# EAGLE design selflace (EAGLE 9.4.0)
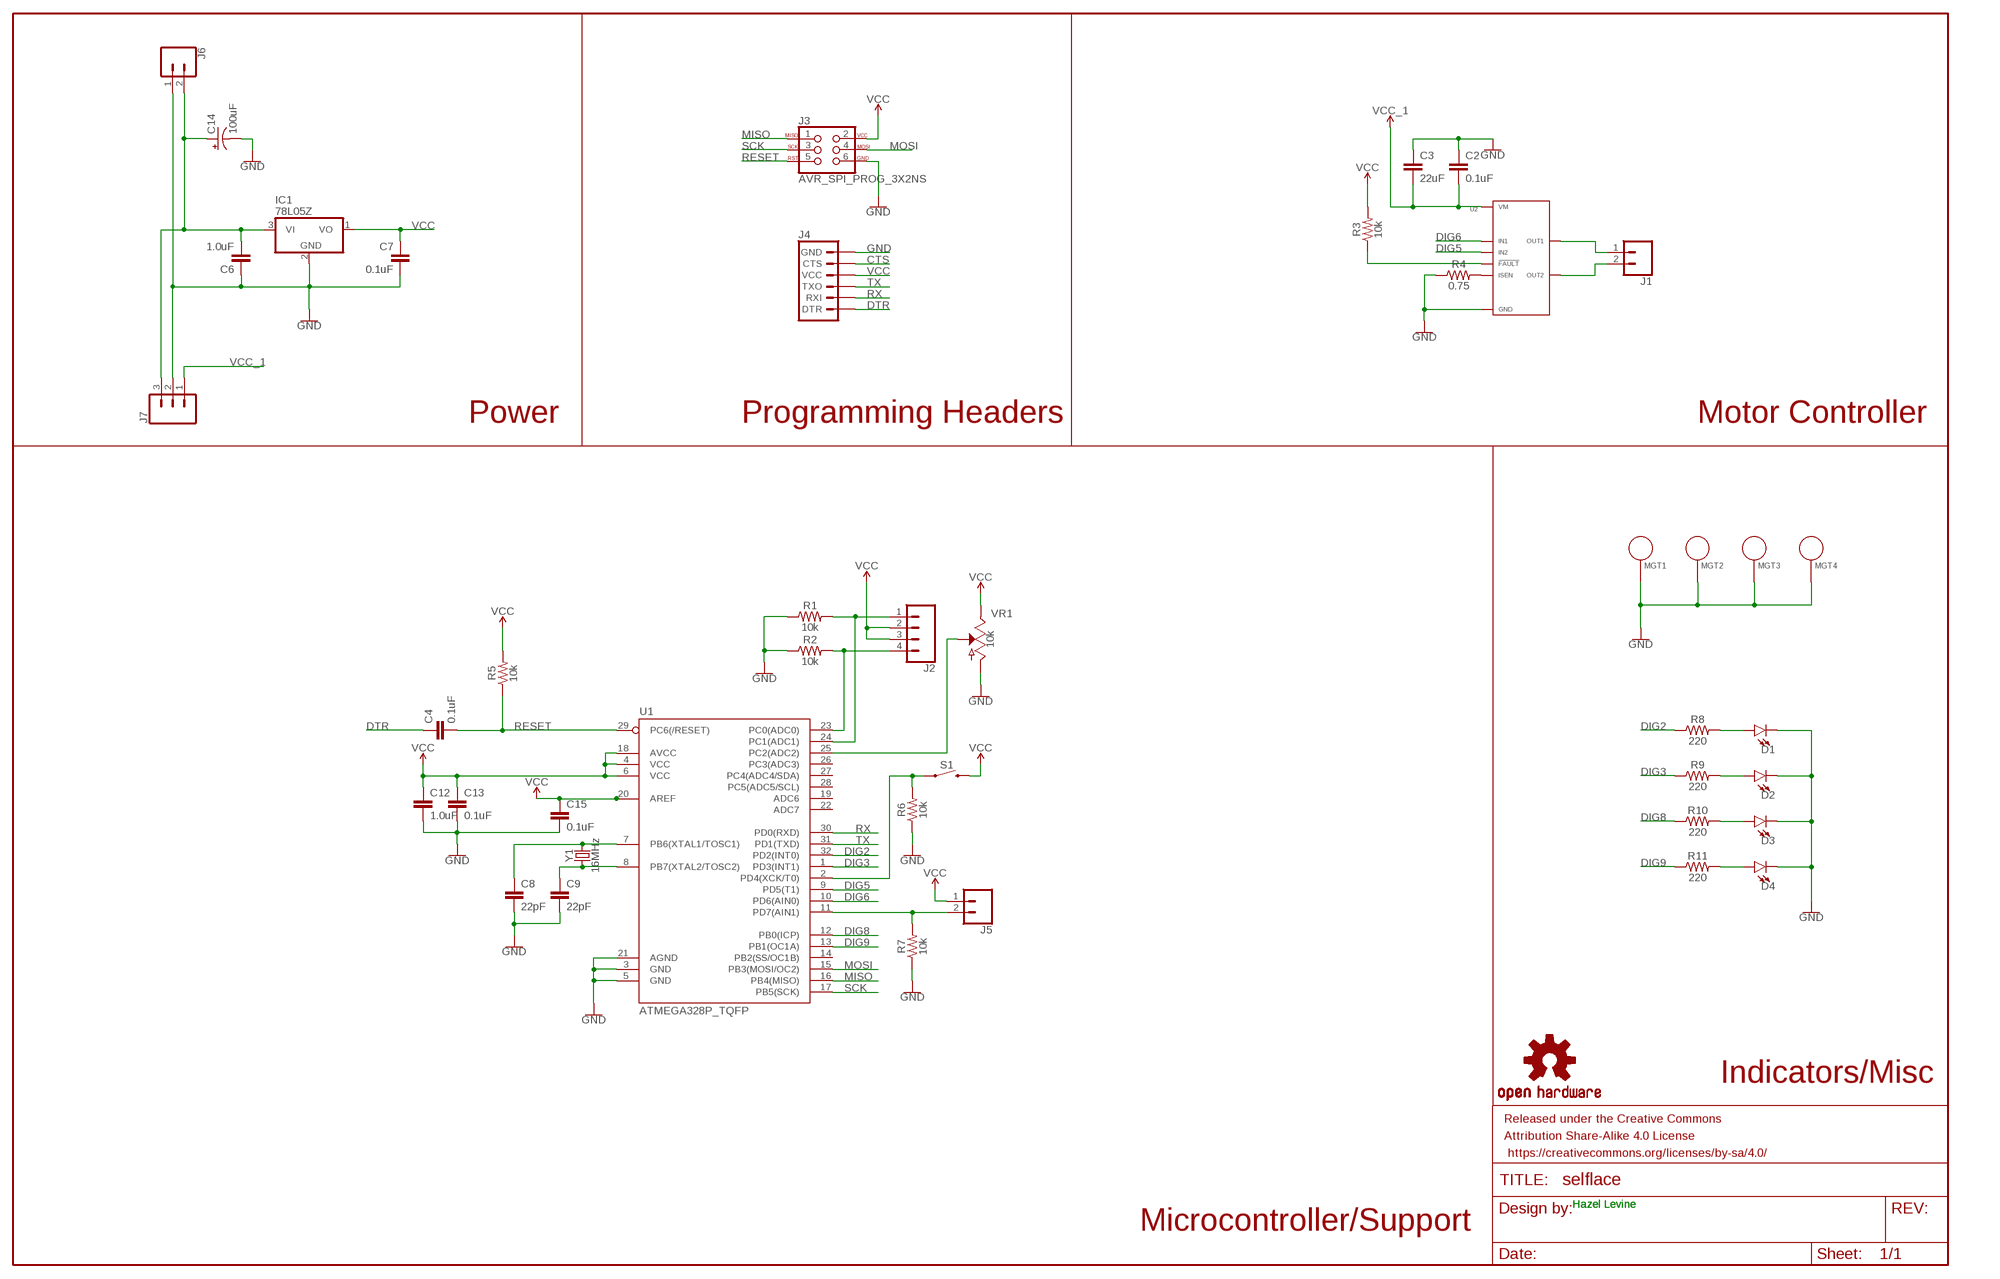
[diagram p0: schematic, sheet 1]

## Parts
C2  0.1uF  0.1UF-0603-25V-(+80/-20%)  [0603]
C3  22uF  22UF-0805-6.3V-20%  [0805]
C4  0.1uF  0.1UF-0603-25V-(+80/-20%)  [0603]
C6  1.0uF  1.0UF-0603-16V-10%  [0603]
C7  0.1uF  0.1UF-0603-25V-(+80/-20%)  [0603]
C8  22pF  22PF-0603-50V-5%  [0603]
C9  22pF  22PF-0603-50V-5%  [0603]
C12  1.0uF  1.0UF-0603-16V-10%  [0603]
C13  0.1uF  0.1UF-0603-25V-(+80/-20%)  [0603]
C14  100uF  100UF-POLAR-10X10.5-63V-20%  [NIC_10X10.5_CAP]
C15  0.1uF  0.1UF-0603-25V-(+80/-20%)  [0603]
D1  LED1206  [LED-1206]
D2  LED1206  [LED-1206]
D3  LED1206  [LED-1206]
D4  LED1206  [LED-1206]
FRAME1  FRAME-LEDGER  [CREATIVE_COMMONS]
IC1  78L05Z  [TO92]
J1  CONN_02  [1X02]
J2  CONN_04  [1X04]
J3  AVR_SPI_PROG_3X2NS  [2X3-NS]
J4  6_PIN_SERIAL_TARGETSILK  [6_PIN_SERIAL_TARGET_SIDE_W_SILK]
J5  CONN_02  [1X02]
J6  CONN_02JST-PTH-2  [JST-2-PTH]
J7  CONN_03  [1X03]
LOGO1  OSHW-LOGOM  [OSHW-LOGO-M]
MGT1  BEAGLEBONEBLACK_MOUNTING_HOLE  [BEAGLEBONEBLACK_MOUNTING_HOLE]
MGT2  BEAGLEBONEBLACK_MOUNTING_HOLE  [BEAGLEBONEBLACK_MOUNTING_HOLE]
MGT3  BEAGLEBONEBLACK_MOUNTING_HOLE  [BEAGLEBONEBLACK_MOUNTING_HOLE]
MGT4  BEAGLEBONEBLACK_MOUNTING_HOLE  [BEAGLEBONEBLACK_MOUNTING_HOLE]
R1  10k  10KOHM-0603-1/10W-1%  [0603]
R2  10k  10KOHM-0603-1/10W-1%  [0603]
R3  10k  10KOHM-0603-1/10W-1%  [0603]
R4  0.75  0.75OHM-0805-1/4W-1%  [0805]
R5  10k  10KOHM-0603-1/10W-1%  [0603]
R6  10k  10KOHM-0603-1/10W-1%  [0603]
R7  10k  10KOHM-0603-1/10W-1%  [0603]
R8  220  220OHM-0603-1/10W-1%  [0603]
R9  220  220OHM-0603-1/10W-1%  [0603]
R10  220  220OHM-0603-1/10W-1%  [0603]
R11  220  220OHM-0603-1/10W-1%  [0603]
S1  MOMENTARY-SWITCH-SPST-PTH-6.0MM  [TACTILE_SWITCH_PTH_6.0MM]
U1  ATMEGA328P_TQFP  [TQFP32-08]
U2  DRV8872DDARQ1  [DRV8872_HSOP-8]
VR1  10k  POTENTIOMETER-PTH-9MM-1/20W-20%  [POT-PTH-ALPS]
Y1  16MHz  CRYSTAL-16MHZSMD-5X3.2  [CRYSTAL-SMD-5X3.2-4PAD]

## Nets
CTS: J4.P$5(CTS)
DIG2: R8.1 U1.32(PD2(INT0))
DIG3: R9.1 U1.1(PD3(INT1))
DIG5: U1.9(PD5(T1)) U2.P$2(IN2)
DIG6: U1.10(PD6(AIN0)) U2.P$3(IN1)
DIG8: R10.1 U1.12(PB0(ICP))
DIG9: R11.1 U1.13(PB1(OC1A))
DTR: C4.1 J4.P$1(DTR)
GND: C2.1 C3.1 C6.1 C7.2 C8.2 C9.2 C12.2 C13.2 C14.- C15.2 D1.C D2.C D3.C D4.C IC1.2(GND) J3.6 J4.P$6(GND) J6.1 J7.2 MGT1.P$1 MGT2.P$1 MGT3.P$1 MGT4.P$1 R1.1 R2.1 R4.1 R6.1 R7.1 U1.3(GND) U1.5(GND) U1.21(AGND) U2.P$1(GND) U2.P$9(GND) U2.P$10(GND) U2.P$11(GND) U2.P$12(GND) U2.P$13(GND) U2.P$14(GND) U2.P$15(GND) VR1.P$3(A)
MISO: J3.1 U1.16(PB4(MISO))
MOSI: J3.4 U1.15(PB3(MOSI/OC2))
N$1: R6.2 S1.1 U1.2(PD4(XCK/T0))
N$2: J5.2 R7.2 U1.11(PD7(AIN1))
N$3: R3.1 U2.P$4(!FAULT)
N$4: J1.1 U2.P$6(OUT1)
N$5: J1.2 U2.P$8(OUT2)
N$6: U1.25(PC2(ADC2)) VR1.P$2(S)
N$7: C8.1 U1.7(PB6(XTAL1/TOSC1)) Y1.3
N$8: R4.2 U2.P$7(ISEN)
N$9: J2.4 R2.2 U1.23(PC0(ADC0))
N$10: J2.1 R1.2 U1.24(PC1(ADC1))
N$11: C9.1 U1.8(PB7(XTAL2/TOSC2)) Y1.1
N$12 [voltage]: C6.2 C14.+ IC1.3(VI) J6.2 J7.3
N$14: D1.A R8.2
N$15: D2.A R9.2
N$16: D3.A R10.2
N$17: D4.A R11.2
RESET: C4.2 J3.5 R5.1 U1.29(PC6(/RESET))
RX: J4.P$3(RXI) U1.30(PD0(RXD))
SCK: J3.3 U1.17(PB5(SCK))
TX: J4.P$2(TXO) U1.31(PD1(TXD))
VCC [voltage]: C7.1 C12.1 C13.1 C15.1 IC1.1(VO) J2.2 J2.3 J3.2 J4.P$4(VCC) J5.1 R3.2 R5.2 S1.3 U1.4(VCC) U1.6(VCC) U1.18(AVCC) U1.20(AREF) VR1.P$1(E)
VCC_1 [voltage]: C2.2 C3.2 J7.1 U2.P$5(VM)
Unconnected: U1.14(PB2(SS/OC1B)) U1.19(ADC6) U1.22(ADC7) U1.26(PC3(ADC3)) U1.27(PC4(ADC4/SDA)) U1.28(PC5(ADC5/SCL))

## Notes on the sheet
- Power | Programming Headers | Motor Controller
- Indicators/Misc
- Hazel Levine | Hazel Levine
- Microcontroller/Support

## Library data of the parts
C2 C4 C7 C13 C15 = SparkFun-Capacitors:0.1UF: 0.1µF ceramic capacitors A capacitor is a passive two-terminal electrical component used to store electrical energy temporarily in an electric field.; PROD_ID: CAP-00810
C3 = SparkFun-Capacitors:22UF: 22µF ceramic capacitors A capacitor is a passive two-terminal electrical component used to store electrical energy temporarily in an electric field.; PROD_ID: CAP-08402
C6 C12 = SparkFun-Capacitors:1.0UF: 1µF ceramic capacitors A capacitor is a passive two-terminal electrical component used to store electrical energy temporarily in an electric field.; PROD_ID: CAP-00868
C8 C9 = SparkFun-Capacitors:22PF: 22pF ceramic capacitors A capacitor is a passive two-terminal electrical component used to store electrical energy temporarily in an electric field.; PROD_ID: CAP-07876
C14 = SparkFun-Capacitors:100UF-POLAR: 100µF polarized capacitors A capacitor is a passive two-terminal electrical component used to store electrical energy temporarily in an electric field.; PROD_ID: CAP-08362
D1-D4 = SparkFun-LED:LED: LED (Generic) Standard schematic elements and footprints for 5mm, 3mm, 1206, and 0603 sized LEDs. Generic LEDs with no color specified.
FRAME1 = SparkFun-Aesthetics:FRAME-LEDGER: Schematic Frame - Ledger Standard 11x14 US Ledger frame
IC1 = linear:78*: Positive VOLTAGE REGULATOR Source: http://cache.national.com/ds/LM/LM78L05.pdf http://www.fairchildsemi.com/ds/LM/LM7805.pdf
J1 J5 = SparkFun-Connectors:CONN_02: Multi connection point. Often used as Generic Header-pin footprint for 0.1 inch spaced/style header connections On any of the 0.1 inch spaced packages, you can populate with these: Break Away Headers - Straight <https://www.sparkfun.com/products/116> (PRT-00116) Break Away Male Headers - Right Angle <https://www.sparkfun.com/products/553> (PRT-00553) Female Headers <https://www.sparkfun.com/products/115> (PRT-00115) Break Away Headers - Machine Pin <https://www.sparkfun.com/products/117> (PRT-00117) Break Away Female Headers - Swiss Machine Pin <https://www.sparkfun.com/products/743> (PRT-00743) For SCREWTERMINALS and SPRING TERMINALS visit here: Screw Terimnals on SparkFun.com <https://www.sparkfun.com/search/results?term=Screw+Terminals> (5mm/3.5mm/2.54mm spacing) This device is also useful as a general connection point to wire up your design to another part of your project. Our various solder wires solder well into these plated through hole pads. Hook-Up Wire - Assortment (Stranded, 22 AWG) <https://www.sparkfun.com/products/11375> (PRT-11375) Hook-Up Wire - Assortment (Solid Core, 22 AWG) <https://www.sparkfun.com/products/11367> (PRT-11367) View the entire wire category on our website here <https://www.sparkfun.com/categories/141> Special notes: Molex polarized connector foot print use with: PRT-08233 with associated crimp pins and housings. 2.54_SCREWTERM for use with PRT-10571. 3.5mm Screw Terminal footprints for PRT-08084 5mm Screw Terminal footprints for use with PRT-08432
J2 = SparkFun-Connectors:CONN_04: Multi connection point. Often used as Generic Header-pin footprint for 0.1 inch spaced/style header connections On any of the 0.1 inch spaced packages, you can populate with these: Break Away Headers - Straight <https://www.sparkfun.com/products/116> (PRT-00116) Break Away Male Headers - Right Angle <https://www.sparkfun.com/products/553> (PRT-00553) Female Headers <https://www.sparkfun.com/products/115> (PRT-00115) Break Away Headers - Machine Pin <https://www.sparkfun.com/products/117> (PRT-00117) Break Away Female Headers - Swiss Machine Pin <https://www.sparkfun.com/products/743> (PRT-00743) For SCREWTERMINALS and SPRING TERMINALS visit here: Screw Terimnals on SparkFun.com <https://www.sparkfun.com/search/results?term=Screw+Terminals> (5mm/3.5mm/2.54mm spacing) This device is also useful as a general connection point to wire up your design to another part of your project. Our various solder wires solder well into these plated through hole pads. Hook-Up Wire - Assortment (Stranded, 22 AWG) <https://www.sparkfun.com/products/11375> (PRT-11375) Hook-Up Wire - Assortment (Solid Core, 22 AWG) <https://www.sparkfun.com/products/11367> (PRT-11367) View the entire wire category on our website here <https://www.sparkfun.com/categories/141> Special notes: Molex polarized connector foot print use with SKU : PRT-08231 with associated crimp pins and housings. 1MM SMD Version SKU: PRT-10208; PROD_ID: CONN-09696
J3 = SparkFun-Connectors:AVR_SPI_PROG_3X2: AVR ISP 6 Pin This is the reduced ISP connector for AVR programming. Common on Arduino. This footprint will take up less PCB space and can be used with a 10-pin to 6-pin adapter such as SKU: BOB-08508 **Special note about "TEST_POINT" package. The stop mask is on the top side, so if you want your programming test points to be on the bottom of your board, make sure to place this package on the bottom side of the board. This also ensure that the orientation to program from the bottom side will be correct. SparkFun Products: SparkFun ISP Pogo Adapter <https://www.sparkfun.com/products/11591> - NS Tiny AVR Programmer <https://www.sparkfun.com/products/11801> -PTH
J4 = SparkFun-Connectors:6_PIN_SERIAL_TARGET: 6-pin header connection for use with the "FTDI BASIC" pinout - TARGET SIDE. Also known as "Arduino Serial Program Header". It is used to mate with our FTDI Basic serial programmers using the Arduino IDE. Note, this device has "TARGET" in the name. It is intended to be used on a design that contains a target micro-controller that you wish to program. The "sister" device, named "CABLE" is inteneded to be used on a design that usually lives on the end of your USB cable and prvides the converter chip (FTDI232 or FTDI231x) to commnicate serial RX/TX. You can populate with some of these: Break Away Headers - Straight <https://www.sparkfun.com/products/116> (PRT-00116) For reference (or to suit your programming needs) check out these designs: SparkFun FTDI Basic Breakout - 5V <https://www.sparkfun.com/products/9716> (DEV-09716) SparkFun FTDI Basic Breakout - 3.3V <https://www.sparkfun.com/products/9873> (DEV-09873) SparkFun FTDI SmartBasic <https://www.sparkfun.com/products/12935> (DEV-12935) SparkFun Beefy 3 - FTDI Basic Breakout <https://www.sparkfun.com/products/13746> (DEV-13746)
J6 = SparkFun-Connectors:CONN_02: Multi connection point. Often used as Generic Header-pin footprint for 0.1 inch spaced/style header connections On any of the 0.1 inch spaced packages, you can populate with these: Break Away Headers - Straight <https://www.sparkfun.com/products/116> (PRT-00116) Break Away Male Headers - Right Angle <https://www.sparkfun.com/products/553> (PRT-00553) Female Headers <https://www.sparkfun.com/products/115> (PRT-00115) Break Away Headers - Machine Pin <https://www.sparkfun.com/products/117> (PRT-00117) Break Away Female Headers - Swiss Machine Pin <https://www.sparkfun.com/products/743> (PRT-00743) For SCREWTERMINALS and SPRING TERMINALS visit here: Screw Terimnals on SparkFun.com <https://www.sparkfun.com/search/results?term=Screw+Terminals> (5mm/3.5mm/2.54mm spacing) This device is also useful as a general connection point to wire up your design to another part of your project. Our various solder wires solder well into these plated through hole pads. Hook-Up Wire - Assortment (Stranded, 22 AWG) <https://www.sparkfun.com/products/11375> (PRT-11375) Hook-Up Wire - Assortment (Solid Core, 22 AWG) <https://www.sparkfun.com/products/11367> (PRT-11367) View the entire wire category on our website here <https://www.sparkfun.com/categories/141> Special notes: Molex polarized connector foot print use with: PRT-08233 with associated crimp pins and housings. 2.54_SCREWTERM for use with PRT-10571. 3.5mm Screw Terminal footprints for PRT-08084 5mm Screw Terminal footprints for use with PRT-08432; PROD_ID: CONN-09863; SKU: PRT-09914
J7 = SparkFun-Connectors:CONN_03: Multi connection point. Often used as Generic Header-pin footprint for 0.1 inch spaced/style header connections On any of the 0.1 inch spaced packages, you can populate with these: Break Away Headers - Straight <https://www.sparkfun.com/products/116> (PRT-00116) Break Away Male Headers - Right Angle <https://www.sparkfun.com/products/553> (PRT-00553) Female Headers <https://www.sparkfun.com/products/115> (PRT-00115) Break Away Headers - Machine Pin <https://www.sparkfun.com/products/117> (PRT-00117) Break Away Female Headers - Swiss Machine Pin <https://www.sparkfun.com/products/743> (PRT-00743) Stackable Header - 3 Pin (Female, 0.1") <https://www.sparkfun.com/products/13875> (PRT-13875) For SCREWTERMINALS and SPRING TERMINALS visit here: Screw Terimnals on SparkFun.com <https://www.sparkfun.com/search/results?term=Screw+Terminals> (5mm/3.5mm/2.54mm spacing) This device is also useful as a general connection point to wire up your design to another part of your project. Our various solder wires solder well into these plated through hole pads. Hook-Up Wire - Assortment (Stranded, 22 AWG) <https://www.sparkfun.com/products/11375> (PRT-11375) Hook-Up Wire - Assortment (Solid Core, 22 AWG) <https://www.sparkfun.com/products/11367> (PRT-11367) View the entire wire category on our website here <https://www.sparkfun.com/categories/141> Special notes: Molex polarized connector foot print use with SKU : PRT-08232 with associated crimp pins and housings.
LOGO1 = SparkFun-Aesthetics:OSHW-LOGO: Open-Source Hardware (OSHW) Logo This logo indicates the piece of hardware it is found on incorporates a OSHW license and/or adheres to the definition of open source hardware found here: http://freedomdefined.org/OSHW
MGT1-MGT4 = BeagleBone_Black_Wireless:BEAGLEBONEBLACK_MOUNTING_HOLE: Chassis Mounting Hole w/GND connection ability
R1-R3 R5-R7 = SparkFun-Resistors:10KOHM: 10kΩ resistor A resistor is a passive two-terminal electrical component that implements electrical resistance as a circuit element. Resistors act to reduce current flow, and, at the same time, act to lower voltage levels within circuits. - Wikipedia; PROD_ID: RES-00824
R4 = SparkFun-Resistors:0.75OHM: 0.75Ω resistor A resistor is a passive two-terminal electrical component that implements electrical resistance as a circuit element. Resistors act to reduce current flow, and, at the same time, act to lower voltage levels within circuits. - Wikipedia; PROD_ID: RES-08474
R8-R11 = SparkFun-Resistors:220OHM: 220Ω resistor A resistor is a passive two-terminal electrical component that implements electrical resistance as a circuit element. Resistors act to reduce current flow, and, at the same time, act to lower voltage levels within circuits. - Wikipedia; PROD_ID: RES-07861
S1 = SparkFun-Switches:MOMENTARY-SWITCH-SPST: Momentary Switch (Pushbutton) - SPST Normally-open (NO) SPST momentary switches (buttons, pushbuttons). Variants PTH-12MM - 12mm square, through-hole Momentary Pushbutton Switch - 12mm Square <https://www.sparkfun.com/products/9190> (COM-09190) PTH-6.0MM, PTH-6.0MM-KIT - 6.0mm square, through-hole Mini Pushbutton Switch <https://www.sparkfun.com/products/97> (COM-00097) KIT package intended for soldering kit's - only one side of pads' copper is exposed. PTH-RIGHT-ANGLE-KIT - Right-angle, through-hole Right Angle Tactile Button <https://www.sparkfun.com/products/10791> - Used on SparkFun BigTime Watch Kit <https://www.sparkfun.com/products/11734> SMD-12MM - 12mm square, surface-mount Tactile Button - SMD (12mm) <https://www.sparkfun.com/products/12993> (COM-12993) Used on SparkFun PicoBoard <https://www.sparkfun.com/products/11888> SMD-4.5MM - 4.5mm Square Trackball Switch Used on SparkFun Blackberry Trackballer Breakout <https://www.sparkfun.com/products/13169> SMD-4.6MMX2.8MM - 4.60mm x 2.80mm, surface mount Used on SparkFun SAMD21 Mini Breakout <https://www.sparkfun.com/products/13664> SMD-5.2MM, SMD-5.2-REDUNDANT - 5.2mm square, surface-mount Mini Pushbutton Switch - SMD <https://www.sparkfun.com/products/8720> (COM-08720) Used on Arduino Pro Mini <https://www.sparkfun.com/products/11114> REDUNDANT package connects both switch circuits together SMD-6.0X3.5MM - 6.0 x 3.5mm, surface mount Momentary Reset Switch SMD <https://www.sparkfun.com/products/8229> (COM-08229) SMD-6.2MM-TALL - 6.2mm square, surface mount Tactile Button - SMD (6mm) <https://www.sparkfun.com/products/12992> Used on SparkFun Digital Sandbox <https://www.sparkfun.com/products/12651> SMD-RIGHT-ANGLE - Right-angle, surface mount Used on SparkFun Block for Intel® Edison - Arduino <https://www.sparkfun.com/products/13036>; PROD_ID: SWCH-08441; SF_SKU: COM-00097
U1 = SparkFun-IC-Microcontroller:ATMEGA328P_TQFP: Popular 328P in QFP Storefront component: ATmega328 - TQFP <https://www.sparkfun.com/products/13448> (COM-13448) Datasheet <http://www.sparkfun.com/datasheets/Components/SMD/ATMega328.pdf> SparkFun Products SparkFun RedBoard - Programmed with Arduino <https://www.sparkfun.com/products/12757> (DEV-12757) Arduino Pro Mini 328 - 5V/16MHz <https://www.sparkfun.com/products/11113> (DEV-11113) Arduino Pro Mini 328 - 3.3V/8MHz <https://www.sparkfun.com/products/11114> (DEV-11114) SparkFun OpenLog <https://www.sparkfun.com/products/13712> (DEV-13712) SparkFun MicroView - OLED Arduino Module <https://www.sparkfun.com/products/12923> (DEV-12923) SparkFun Digital Sandbox <https://www.sparkfun.com/products/12651> (DEV-12651) SparkFun PicoBoard <https://www.sparkfun.com/products/11888> (WIG-11888) Arduino Fio <https://www.sparkfun.com/products/10116> (DEV-10116) LilyPad Arduino 328 Main Board <https://www.sparkfun.com/products/13342> (DEV-13342) SparkFun RedStick <https://www.sparkfun.com/products/13741> (DEV-13741) LilyPad MP3 <https://www.sparkfun.com/products/11013> (DEV-11013) LilyPad Arduino SimpleSnap <https://www.sparkfun.com/products/10941> (DEV-10941) SparkFun Stepoko <https://www.sparkfun.com/products/13899> (ROB-13899) SparkFun Geiger Counter <https://www.sparkfun.com/products/11345> (SEN-11345) SparkFun EL Sequencer <https://www.sparkfun.com/products/12781> (COM-12781) Arduino Pro 328 - 5V/16MHz <https://www.sparkfun.com/products/10915> (DEV-10915) CryptoCape <https://www.sparkfun.com/products/12773> (DEV-12773) SparkFun IR Thermometer Evaluation Board - MLX90614 <https://www.sparkfun.com/products/10740> (SEN-10740) SparkFun RedBot Mainboard <https://www.sparkfun.com/products/12097> (ROB-12097) Arduino Pro 328 - 3.3V/8MHz <https://www.sparkfun.com/products/10914> (DEV-10914) SparkFun Block for Intel® Edison - Arduino <https://www.sparkfun.com/products/13036> (DEV-13036) SparkFun Simon Says - Surface Mount Soldering Kit <https://www.sparkfun.com/products/10935> (KIT-10935) SparkFun 7-Segment Serial Display - Red <https://www.sparkfun.com/products/11441> (COM-11441) SparkFun 7-Segment Serial Display - White <https://www.sparkfun.com/products/11629> (COM-11629) SparkFun 7-Segment Serial Display - Yellow <https://www.sparkfun.com/products/11443> (COM-11443) SparkFun 7-Segment Serial Display - Kelly Green <https://www.sparkfun.com/products/11440> (COM-11440) SparkFun 7-Segment Serial Display - Blue <https://www.sparkfun.com/products/11442> (COM-11442) SparkFun OpenSegment Serial Display - 20mm (Blue) <https://www.sparkfun.com/products/11647> (COM-11647) SparkFun OpenSegment Serial Display - 20mm (Green) <https://www.sparkfun.com/products/11646> (COM-11646) SparkFun OpenSegment Serial Display - 20mm (White) <https://www.sparkfun.com/products/11648> (COM-11648) SparkFun OpenSegment Serial Display - 20mm (Red) <https://www.sparkfun.com/products/11644> (COM-11644) SparkFun OpenSegment Serial Display - 20mm (Yellow) <https://www.sparkfun.com/products/11645> (COM-11645) SparkFun OpenSegment Shield <https://www.sparkfun.com/products/13190> (DEV-13190); PROD_ID: IC-09069
U2 = PP_PowerIC:DRV8872
VR1 = SparkFun-Resistors:POTENTIOMETER: Potentiometer (Pot) Three-terminal potentiometers, with an adjustable wiper and two adjustable resistors. A pot can be used to create a configurable voltage divider, or as a variable resistor. Variants ALPS_POT and ALPS_POT_KIT - PTH, breadboard compatible, 9mm square pots Rotary Potentiometer - Linear (10k ohm) <https://www.sparkfun.com/products/9288> (COM-09288) The KIT variant exposes copper on only one side of the PTH pad, so the part can only be assembled on one side of the PCB. Useful for beginner soldering kits.; PROD_ID: RES-09177; SF_SKU: COM-09288
Y1 = SparkFun-Clocks:CRYSTAL-16MHZ: 16MHz Crystal Digikey Example <http://www.digikey.com/product-search/en?keywords=535-9122-1-ND> Frequency: 16MHz Frequency Stability: ±50ppm Frequency Tolerance: ±20ppm Load Capacitance: 18pF SparkFun Products: Pro Micro -5V/16MHz <https://www.sparkfun.com/products/12640> SparkFun Serial Enabled LCD Kit <https://www.sparkfun.com/products/10097>; PROD_ID: XTAL-08218; SF_ID: COM-00094

## Net classes
1 voltage: width 0.406 mm

## Board
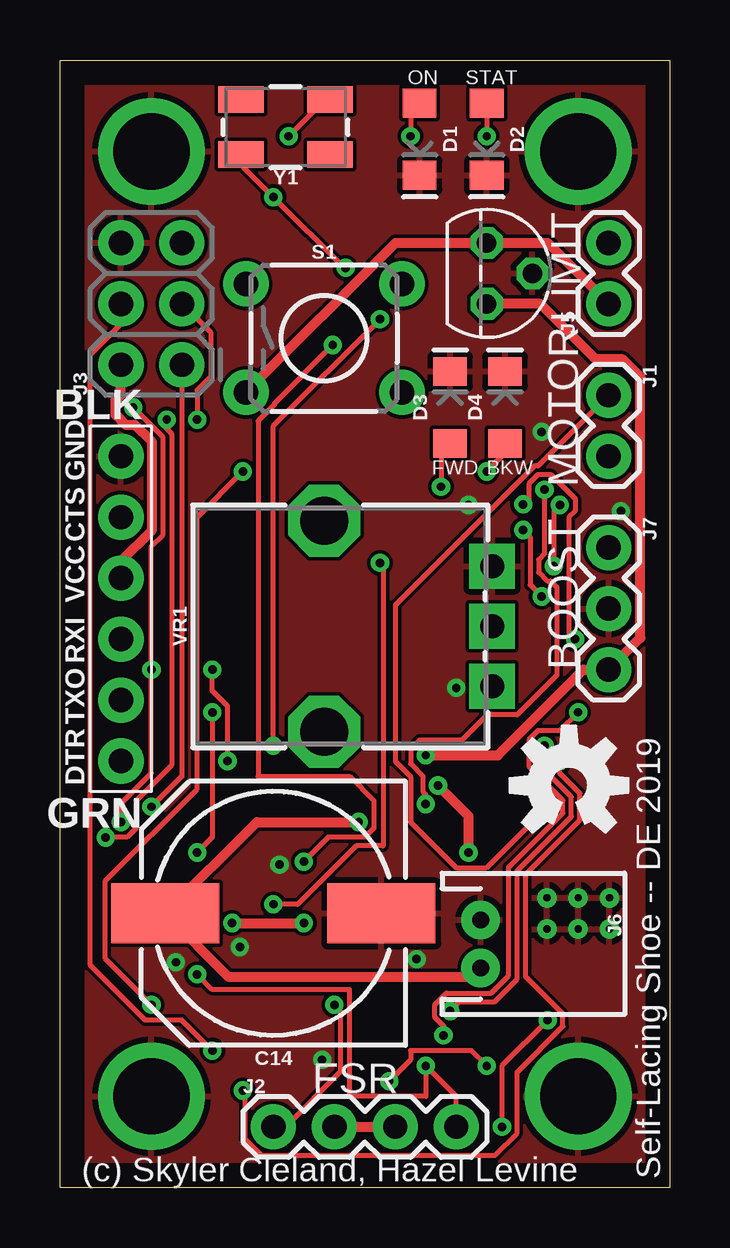
[diagram p1: board, top side]
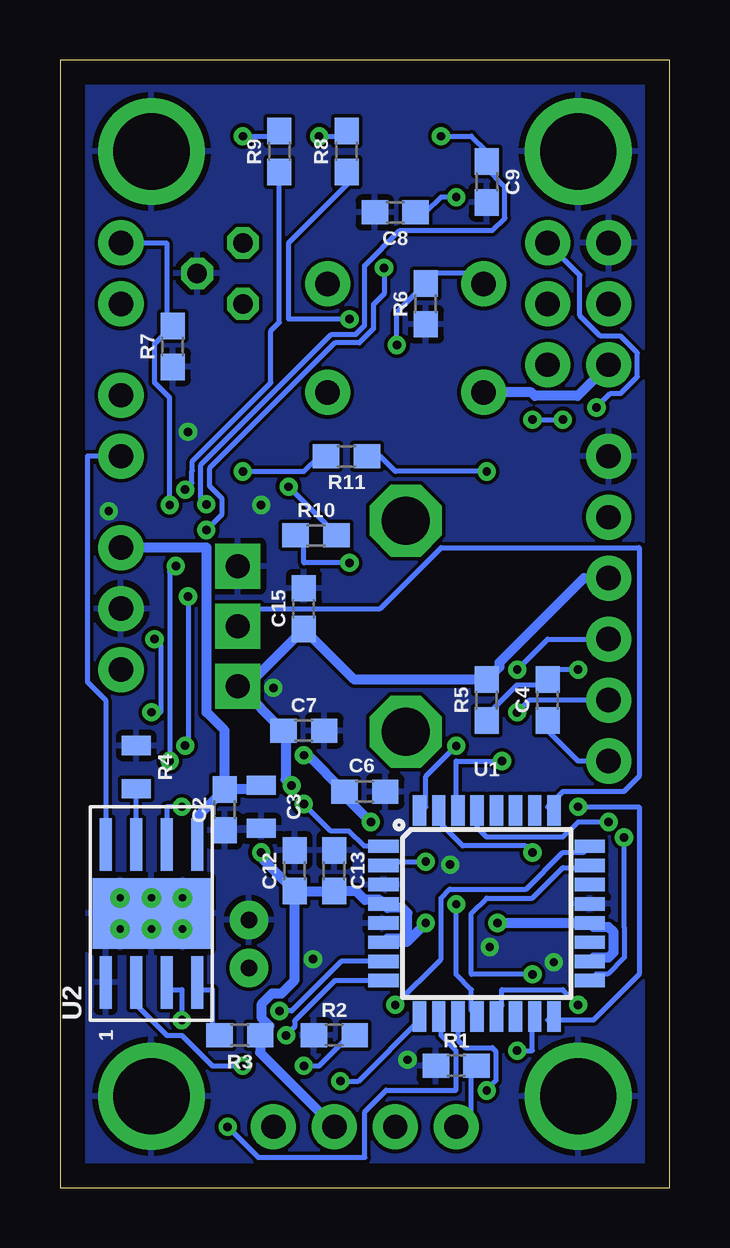
[diagram p2: board, bottom side, seen from below]

Size 25.4 x 46.99 mm. Coordinates in mm from the lower left corner, seen from the top.
Outline: 0,46.99 25.4,46.99 25.4,0 0,0 0,46.99
Copper layers (1*16): Top 0.035mm / dielectric 1.5mm / Bottom 0.035mm
Design rules "default *": minimum track width 8mil, minimum drill 0.35mm, track to track 6mil, track to pad 6mil, pad to pad 6mil, via to via 6mil, smd to smd 6mil, copper to edge 40mil, drill to drill 6mil, minimum pad ring 10mil, minimum via ring 8mil, stop-mask expansion 4mil, vias tented up to drill 0mil, thermal gap 10mil

### Footprints (pad centres in the part's own frame; a part is rotated, then mirrored left to right if it is on the bottom)
0603 = smd 1.1 x 1: 1 -0.85,0; 2 0.85,0
0805 = smd 0.8 x 1.2: 1 -0.9,0; 2 0.9,0
NIC_10X10.5_CAP = smd 4.5 x 2.5: + 4.5,0; - -4.5,0
LED-1206 = smd 1.2 x 1.4: A -1.5,0; C 1.5,0
TO92 = drill 0.813 octagon: 1 -1.27,0; 2 0,1.905; 3 1.27,0
1X02 = drill 1.016 pad 1.88: 1 0,0; 2 2.54,0
1X04 = drill 1.016 pad 1.88: 1 0,0; 2 2.54,0; 3 5.08,0; 4 7.62,0
2X3-NS = drill 1.016 pad 1.88: 1 -2.54,-1.27; 2 -2.54,1.27; 3 0,-1.27; 4 0,1.27; 5 2.54,-1.27; 6 2.54,1.27
6_PIN_SERIAL_TARGET_SIDE_W_SILK = drill 1.016 pad 1.88: P$1 -6.35,0; P$2 -3.81,0; P$3 -1.27,0; P$4 1.27,0; P$5 3.81,0; P$6 6.35,0
JST-2-PTH = drill 0.7 pad 1.6: 1 -1,0; 2 1,0
1X03 = drill 1.016 pad 1.88: 1 0,0; 2 2.54,0; 3 5.08,0
BEAGLEBONEBLACK_MOUNTING_HOLE = drill 3.175 pad 4.445: P$1 0,0
TACTILE_SWITCH_PTH_6.0MM = drill 1.016 pad 1.88: 1 -3.251,2.261; 2 3.251,2.261; 3 -3.251,-2.261; 4 3.251,-2.261
TQFP32-08 = smd 1.27 x 0.559: 1 -4.293,2.8; 2 -4.293,2; 3 -4.293,1.2; 4 -4.293,0.4; 5 -4.293,-0.4; 6 -4.293,-1.2; 7 -4.293,-2; 8 -4.293,-2.8; 17 4.293,-2.8; 18 4.293,-2; 19 4.293,-1.2; 20 4.293,-0.4; 21 4.293,0.4; 22 4.293,1.2; 23 4.293,2; 24 4.293,2.8 | smd 0.559 x 1.27: 9 -2.8,-4.293; 10 -2,-4.293; 11 -1.2,-4.293; 12 -0.4,-4.293; 13 0.4,-4.293; 14 1.2,-4.293; 15 2,-4.293; 16 2.8,-4.293; 25 2.8,4.293; 26 2,4.293; 27 1.2,4.293; 28 0.4,4.293; 29 -0.4,4.293; 30 -1.2,4.293; 31 -2,4.293; 32 -2.8,4.293
DRV8872_HSOP-8 = smd 2.2 x 0.5: P$1 -2.875,1.905; P$2 -2.875,0.635; P$3 -2.875,-0.635; P$4 -2.875,-1.905; P$5 2.875,-1.905; P$6 2.875,-0.635; P$7 2.875,0.635; P$8 2.875,1.905 | smd 2.95 x 4.9: P$9 0,0 | drill 0.305 pad 0.406: P$10 -0.65,1.3; P$11 -0.65,0; P$12 -0.65,-1.3; P$13 0.65,-1.3; P$14 0.65,0; P$15 0.65,1.3
POT-PTH-ALPS = drill 1 pad 1.88 square: P$1 7,-2.5; P$2 7,0; P$3 7,2.5 | drill 2 octagon: P$4 0,-4.4; P$5 0,4.4
CRYSTAL-SMD-5X3.2-4PAD = smd 1.9 x 1.1: 1 -1.85,-1.15; 2 1.85,-1.15; 3 1.85,1.15; 4 -1.85,1.15

### Placement (x,y rotation side)
C2  18.54,15.75 90 bottom
C3  17.02,15.88 90 bottom
C4  5.08,20.32 90 bottom
C6  12.7,16.51 180 bottom
C7  15.24,19.05 0 bottom
C8  11.43,40.64 180 bottom
C9  7.62,41.91 270 bottom
C12  15.62,13.21 90 bottom
C13  13.97,13.21 90 bottom
C14  8.89,11.43 180 top
C15  15.24,24.13 90 bottom
D1  14.99,43.69 270 top
D2  17.78,43.69 270 top
D3  16.26,32.51 90 top
D4  18.54,32.51 90 top
FRAME1  20.83,-7.87 0 top  (outside the outline)
IC1  17.78,38.1 270 top
J1  22.86,33.02 270 top
J2  8.89,2.54 0 top
J3  3.81,36.83 90 top
J4  2.54,24.13 90 top
J5  22.86,36.83 90 top
J6  17.53,10.16 270 top
J7  22.86,26.67 270 top
LOGO1  21.21,16.76 0 top
MGT1  3.81,3.81 0 top
MGT2  21.59,3.81 0 top
MGT3  21.59,43.18 0 top
MGT4  3.81,43.18 0 top
R1  8.89,5.08 0 bottom
R2  13.97,6.35 0 bottom
R3  17.91,6.35 0 bottom
R4  22.23,17.53 270 bottom
R5  7.62,20.32 90 bottom
R6  10.16,36.83 90 bottom
R7  20.7,35.05 90 bottom
R8  13.46,43.18 90 bottom
R9  16.26,43.18 90 bottom
R10  14.73,27.18 0 bottom
R11  13.46,30.48 180 bottom
S1  11,35.4 0 top
U1  7.62,11.43 0 bottom
U2  21.59,11.43 90 bottom
VR1  11,23.4 0 top
Y1  9.4,44.2 180 top

### Tracks (layer width: path | path; a pad name or v marks a point on that pad's centre or on a via)
DIG2  (via drill 0.35)
  Top 0.203: v13.34,36.2 8.89,31.75 v8.89,18.41
  Bottom 0.203: v13.34,36.2 15.88,36.2 15.88,39.37 13.34,41.91 R8.1 | v8.89,18.41 10.16,17.14 10.16,15.88 U1.32
DIG3  (via drill 0.35)
  Top 0.203: v15.24,15.99 15.24,16.38 15.12,16.5 15.12,17.15 14.61,17.66 14.61,18.28 14.98,18.65 16.74,18.65 17.8,19.71 19.05,19.71 20.7,21.36 20.7,25.02 20.44,25.28 20.31,25.28 19.94,25.65 19.94,26.17 20.18,26.41 v20.18,29.09
  Bottom 0.203: v15.24,15.99 14.11,14.86 13.37,14.86 12.73,14.23 U1.1 | v20.18,29.09 | v20.18,29.09 19.91,29.37 19.91,29.87 19.89,29.89 19.89,30.27 16.61,33.54 16.61,35.71 16.26,36.06 R9.1
DIG5  (via drill 0.35)
  Top 0.203: v13.72,4.45 14.61,5.33 14.61,5.71 17.14,5.71 v17.78,5.08
  Bottom 0.203: v13.72,4.45 12.95,4.45 10.32,7.08 U1.9 | v17.78,5.08 19.05,5.08 20.32,6.35 20.95,6.35 22.23,7.62 U2.P$2
DIG6  (via drill 0.35)
  Top 0.203: v18.41,2.54 18.41,5.08 v20.32,6.99
  Bottom 0.203: v18.41,2.54 17.14,1.27 12.7,1.27 12.7,3.17 11.81,4.06 8.89,4.06 8.89,5.71 9.53,6.35 9.53,6.99 U1.10 | v20.32,6.99 20.32,8.26 20.95,8.26 U2.P$3
DIG8  (via drill 0.35)
  Top 0.203: v8.89,11.81 9.91,11.81 12.34,14.25 13.46,14.25 13.46,25.91 v13.34,26.04
  Bottom 0.203: v13.34,26.04 15.24,26.04 15.24,27.3 R10.1 | U1.12 8.26,7.37 8.26,8.26 8.89,8.89 v8.89,11.81
DIG9  (via drill 0.35)
  Top 0.203: v3.81,7.62 1.89,9.54 1.89,12.79 5.71,16.61 5.71,27.94 v7.62,29.84
  Bottom 0.203: v7.62,29.84 11.43,29.84 12.06,30.48 R11.1 | v3.81,7.62 4.45,8.26 6.99,8.26 6.99,7.62 U1.13
DTR
  Bottom 0.203: J4.P$1 3.81,17.78 5.08,19.05 C4.1
GND  (via drill 0.35)
  other vias: 4.83,9.4 7.49,10.03 9.14,13.46 10.92,5.33 14.86,9.53 20.07,31.5 16.51,20.83 17.02,28.45 23.37,28.19
  pour Top: 0,0 0,46.99 25.4,46.99 25.4,0
  pour Bottom: 0,0 0,46.99 25.4,46.99 25.4,0
MISO  (via drill 0.35)
  Top 0.203: v3.81,15.88 5.08,17.14 J3.1
  Bottom 0.203: v3.81,15.88 1.27,15.88 1.27,8.89 3.17,6.99 5.08,6.99 U1.16
MOSI  (via drill 0.35)
  Top 0.203: v6.35,5.71 5.08,6.99 3.55,6.99 1.27,9.27 1.27,34.71 2.54,35.98 J3.4
  Bottom 0.203: v6.35,5.71 5.71,5.71 5.71,6.99 U1.15
N$1  (via drill 0.35)
  Top 0.203: v10.16,13.59 11.18,14.61 12.71,14.61 13.08,14.98 13.08,16.13 12.06,17.14 8.26,17.14 8.26,31.96 8.94,32.65 8.94,32.7 v11.36,35.12
  Bottom 0.203: S1.1 8.26,38.1 10.16,38.1 R6.2 11.36,36.48 v11.36,35.12 | U1.2 11.75,13.59 v10.16,13.59
N$2  (via drill 0.35)
  Top 0.203: v7.62,4.05 7.7,3.97 7.7,2.05 8.4,1.35 18.11,1.35 19.05,2.28 19.05,4.82 20.95,6.72 20.95,7.25 19.41,8.79 19.41,13.06 21.66,15.32 21.66,16.43 20.83,17.27 v20.83,17.78 | v20.57,25.91 20.57,28.19 v20.83,28.45
  Bottom 0.203: J5.2 20.95,39.37 20.95,36.2 20.71,35.91 | 20.71,35.91 R7.2 | U1.11 8.82,6.15 8.51,5.83 7.38,5.83 7.24,5.68 7.24,4.47 7.62,4.09 v7.62,4.05 | v20.57,25.91 20.83,25.65 v20.83,17.78 | v20.83,28.45 20.83,32.92 21.45,33.55 21.45,35.17 20.71,35.91
N$3
  Bottom 0.203: R3.1 19.05,6.35 19.05,8.26 19.68,8.26 U2.P$4
N$4  (via drill 0.35)
  Top 0.203: v20.32,15.88 17.78,13.34 16.51,13.34 14.61,15.24 14.61,17.13 13.97,17.77 13.97,24.27 19.78,30.08 19.92,30.08 J1.1
  Bottom 0.203: U2.P$6 20.95,15.88 v20.32,15.88
N$5
  Bottom 0.203: U2.P$8 23.5,20.32 24.26,21.08 24.26,30.48 J1.2
N$6
  Bottom 0.203: U1.25 5.08,15.88 4.45,16.51 1.91,16.51 1.27,17.14 1.27,26.67 9.53,26.67 12.06,24.13 17.14,24.13 17.78,23.5 VR1.P$2
N$7  (via drill 0.35)
  Top 0.203: Y1.3 7.62,42.55 v8.89,41.27 11.84,38.33 v11.9,38.33 | v20.07,24.64 19.59,25.12 19.59,27.12 v19.3,27.4 | v20.07,24.64 | v20.18,18.42 v20.2,18.41 20.2,17.4 21.31,16.28 21.31,15.47 19.05,13.21 19.05,8.69 18.11,7.75 16.64,7.75 v16.26,7.37
  Bottom 0.203: v8.89,41.27 9.53,41.27 10.16,40.64 C8.1 | v11.9,38.33 11.9,37.25 12.35,36.8 12.35,35.79 12.93,35.21 13.94,35.21 19.18,29.97 19.18,29.25 18.67,28.74 18.67,28.04 v19.3,27.4 | v20.07,24.64 20.07,18.54 v20.18,18.42 | U1.7 13.68,9.43 15.75,7.37 v16.26,7.37
N$8
  Bottom 0.203: U2.P$7 R4.2
N$9  (via drill 0.35)
  Top 0.203: J2.4 16.51,3.81 v15.24,5.08 15.24,3.81 12.06,3.81 12.06,8.26 6.35,8.26 v5.71,8.89
  Bottom 0.203: v15.24,5.08 14.61,5.08 13.34,6.35 R2.2 | v5.71,8.89 8.26,8.89 8.26,11.43 7.62,12.06 5.71,12.06 4.45,13.34 3.81,13.34 U1.23
N$10  (via drill 0.35)
  Top 0.203: J2.1 9.4,2.54 11.68,4.83 11.68,7.37 v11.43,7.62
  Bottom 0.203: J2.1 8.26,2.54 8.26,5.08 R1.2 | U1.24 3.59,13.97 4.45,13.97 5.97,12.44 9.15,12.44 9.52,12.07 9.52,9.53 v11.43,7.62
N$11  (via drill 0.35)
  Top 0.203: v9.53,43.81 10.79,45.09 Y1.1 | v15.98,6.35 15.98,6.75 15.62,7.1 15.62,7.63 16.1,8.11 17.96,8.11 18.69,8.84 18.69,13.36 20.95,15.61 20.95,16.14 19.55,17.54 19.55,18.68 19.92,19.05 20.83,19.05 v21.59,19.81 | v21.46,22.86 21.21,23.12 21.21,27.93 21.46,28.19 21.46,28.71 21.09,29.08 20.82,29.35 20.45,29.72 19.92,29.72 19.55,29.35 19.55,28.47 v19.3,28.47
  Bottom 0.203: v9.53,43.81 8.26,43.81 7.62,43.18 C9.1 7.62,42.47 6.87,41.72 6.87,40.41 7.38,39.89 11.23,39.89 12.7,38.42 12.7,35.93 13.07,35.56 14.09,35.56 19.53,30.12 19.53,28.71 v19.3,28.47 | v15.98,6.35 15.62,6.7 15.62,6.96 13.95,8.63 U1.8 | v21.59,19.81 21.21,19.81 21.21,22.61 v21.46,22.86
N$12  (via drill 0.35)
  Top 0.406: J6.2 17.14,8.78 7.04,8.78 C14.+ 8.2,15.24 v12.45,15.24 | IC1.3 20.01,36.83 22.32,34.52 23.44,34.52 24.18,33.78 24.18,22.91 J7.3 21.81,21.59 18.24,18.02 v15.24,18.02
  Bottom 0.406: v12.45,15.24 13.55,16.34 C6.2 15.06,18.02 v15.24,18.02
N$14  (via drill 0.35)
  Top 0.203: v14.61,43.81 14.61,45.09 D1.A
  Bottom 0.203: v14.61,43.81 13.34,43.81 R8.2
N$15  (via drill 0.35)
  Top 0.203: D2.A v17.78,43.81
  Bottom 0.203: v17.78,43.81 16.51,43.81 R9.2
N$16  (via drill 0.35)
  Top 0.203: v15.88,29.21 15.88,30.48 D3.A
  Bottom 0.203: v15.88,29.21 13.97,27.3 R10.2
N$17  (via drill 0.35)
  Top 0.203: v17.78,29.84 18.41,30.48 D4.A
  Bottom 0.203: v17.78,29.84 15.24,29.84 14.61,30.48 R11.2
RESET  (via drill 0.35)
  Top 0.203: v2.54,15.24 2.54,16 3.81,17.27 v3.81,21.59 3.81,26.73 4.29,27.21 4.29,31.27 3.82,31.74 v3.05,32.51
  Bottom 0.203: R5.1 7.62,19.68 6.35,20.95 5.08,20.95 C4.2 5.08,21.59 v3.81,21.59 | v2.54,15.24 3.81,15.24 4.45,14.61 7.62,14.61 8.02,15.01 U1.29 | v3.05,32.51 2.46,33.1 2.05,33.1 1.35,33.8 1.35,34.78 2.05,35.48 2.88,35.48 3.73,36.34 3.73,38.02 J3.5
RX  (via drill 0.35)
  Top 0.203: v6.35,21.59 6.35,20.7 6.98,20.07 v6.98,17.78
  Bottom 0.203: v6.98,17.78 8.89,17.78 8.89,15.88 U1.30 | v6.35,21.59 5.08,22.86 J4.P$3
SCK  (via drill 0.35)
  Top 0.203: v5.71,32 5.71,33.23 6.27,33.8 6.27,35.64 J3.3 | v1.9,14.59 1.92,14.61 2.8,14.61 3.17,14.98 3.17,16.13 4.65,17.61 4.65,31.41 4.45,31.61 v4.45,32
  Bottom 0.203: v5.71,32 v4.45,32 | U1.17 3.06,8.9 2.59,8.9 1.88,9.6 1.88,10.85 1.9,10.87 v1.9,14.59
TX  (via drill 0.35)
  Top 0.203: v5.71,13.97 6.35,14.61 v6.35,19.81
  Bottom 0.203: v5.71,13.97 5.99,14.25 8.62,14.25 9.62,15.25 U1.31 | J4.P$2 5.84,20.32 v6.35,19.81
VCC  (via drill 0.35)
  Top 0.406: v7.17,11.03 v10.16,11.03 | S1.3 13.98,39.37 IC1.1 20.32,39.37 J5.1 | v15.75,16.76 17.02,15.49 v17.02,13.97 | J2.2 J2.3 | J4.P$4 2.54,26.11 3.83,27.4 3.83,31.08 3.13,31.78 2.74,31.78 2.31,32.21 2.31,32.82 2.54,33.04 J3.2
  Bottom 0.406: C12.1 C13.1 13.06,12.36 12.7,11.99 12.08,11.99 U1.4 11.75,11.66 11.13,11.66 10.92,11.46 10.92,10.6 11.13,10.39 11.75,10.39 U1.6 10.96,10.23 v10.16,11.03 | U1.18 3.16,9.6 2.54,9.6 2.34,9.8 2.34,10.66 2.54,10.87 3.16,10.87 U1.20 v7.17,11.03 | S1.3 5.76,33.14 5.62,32.99 3.83,32.99 J3.2 | C12.1 17.02,13.76 v17.02,13.97 | v15.75,16.76 16,17.02 16,18.96 C7.1 17.94,20.9 VR1.P$1 17.62,20.9 C15.1 13.13,21.17 R5.2 7.08,21.71 7.08,21.89 3.58,25.4 J4.P$4 | J2.3 17.06,5.63 R3.2 16.67,6.74 16.99,7.06 16.99,7.67 16.56,8.1 16.17,8.1 15.62,8.65 C12.1
VCC_1
  Bottom 0.406: C2.2 19.68,15.46 U2.P$5 | C3.2 17.2,16.6 C2.2 | J7.1 19.3,26.67 19.3,26.66 19.3,19.81 18.54,19.06 C2.2

### Text on the board
tPlace: ON | STAT | LIMIT | FWD | BKW | MOTOR | BOOST | FSR | (c) Skyler Cleland, Hazel Levine | Self-Lacing Shoe -- DE 2019